# Altium schematic sheet MainBoard.SchDoc
size A3
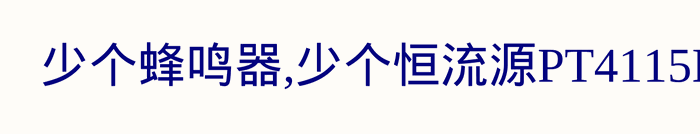
[diagram p0: MainBoard.SchDoc]

## Notes on the sheet
- 少个蜂鸣器,少个恒流源PT4115B89E-B